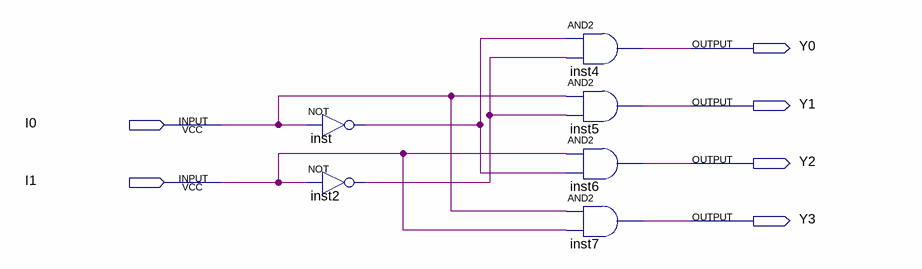
[diagram p0: schematic sheet]
// Quartus schematic 24_decoder.bdf as structural Verilog: 6 symbols, 6 pins
module \24_decoder  (
  input  I0,
  input  I1,
  output Y0,
  output Y1,
  output Y2,
  output Y3
);

  wire inst2_out, inst_out;

  not inst (inst_out, I0);
  not inst2 (inst2_out, I1);
  and inst4 (Y0, inst_out, inst2_out);
  and inst5 (Y1, I0, inst2_out);
  and inst6 (Y2, I1, inst_out);
  and inst7 (Y3, I0, I1);
endmodule
